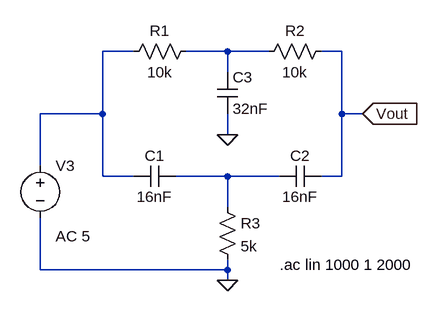
[diagram p0: schematic Passive-Twin-T-Notch-Filter.asc]
Passive-Twin-T-Notch-Filter.asc, the LTspice schematic file:
Version 4
SHEET 1 880 680
WIRE -112 -112 -160 -112
WIRE 32 -112 -32 -112
WIRE 96 -112 32 -112
WIRE 208 -112 176 -112
WIRE 32 -80 32 -112
WIRE -160 -16 -160 -112
WIRE -160 -16 -256 -16
WIRE 208 -16 208 -112
WIRE 240 -16 208 -16
WIRE 32 16 32 -16
WIRE -256 64 -256 -16
WIRE -160 80 -160 -16
WIRE -112 80 -160 80
WIRE 32 80 -48 80
WIRE 112 80 32 80
WIRE 208 80 208 -16
WIRE 208 80 176 80
WIRE 32 128 32 80
WIRE -256 224 -256 144
WIRE 32 224 32 208
WIRE 32 224 -256 224
WIRE 32 240 32 224
FLAG 32 16 0
FLAG 32 240 0
FLAG 240 -16 Vout
IOPIN 240 -16 In
SYMBOL res 16 112 R0
SYMATTR InstName R3
SYMATTR Value 5k
SYMBOL res 192 -128 R90
WINDOW 0 0 56 VBottom 2
WINDOW 3 32 56 VTop 2
SYMATTR InstName R2
SYMATTR Value 10k
SYMBOL res -16 -128 R90
WINDOW 0 0 56 VBottom 2
WINDOW 3 32 56 VTop 2
SYMATTR InstName R1
SYMATTR Value 10k
SYMBOL cap -48 64 R90
WINDOW 0 0 32 VBottom 2
WINDOW 3 32 32 VTop 2
SYMATTR InstName C1
SYMATTR Value 16nF
SYMBOL cap 176 64 R90
WINDOW 0 0 32 VBottom 2
WINDOW 3 32 32 VTop 2
SYMATTR InstName C2
SYMATTR Value 16nF
SYMBOL voltage -256 48 R0
WINDOW 123 24 124 Left 2
WINDOW 39 0 0 Left 0
SYMATTR InstName V3
SYMATTR Value ""
SYMATTR Value2 AC 5
SYMBOL cap 16 -80 R0
SYMATTR InstName C3
SYMATTR Value 32nF
TEXT 112 216 Left 2 !.ac lin 1000 1 2000

The netlist it stands for:
* Passive-Twin-T-Notch-Filter.asc
R3 N003 0 5k
R2 Vout N002 10k
R1 N002 N001 10k
C1 N003 N001 16nF
C2 Vout N003 16nF
V3 N001 0 AC 5
C3 N002 0 32nF
.ac lin 1000 1 2000
.backanno
.end